# Altium project MB1297.PrjPcb
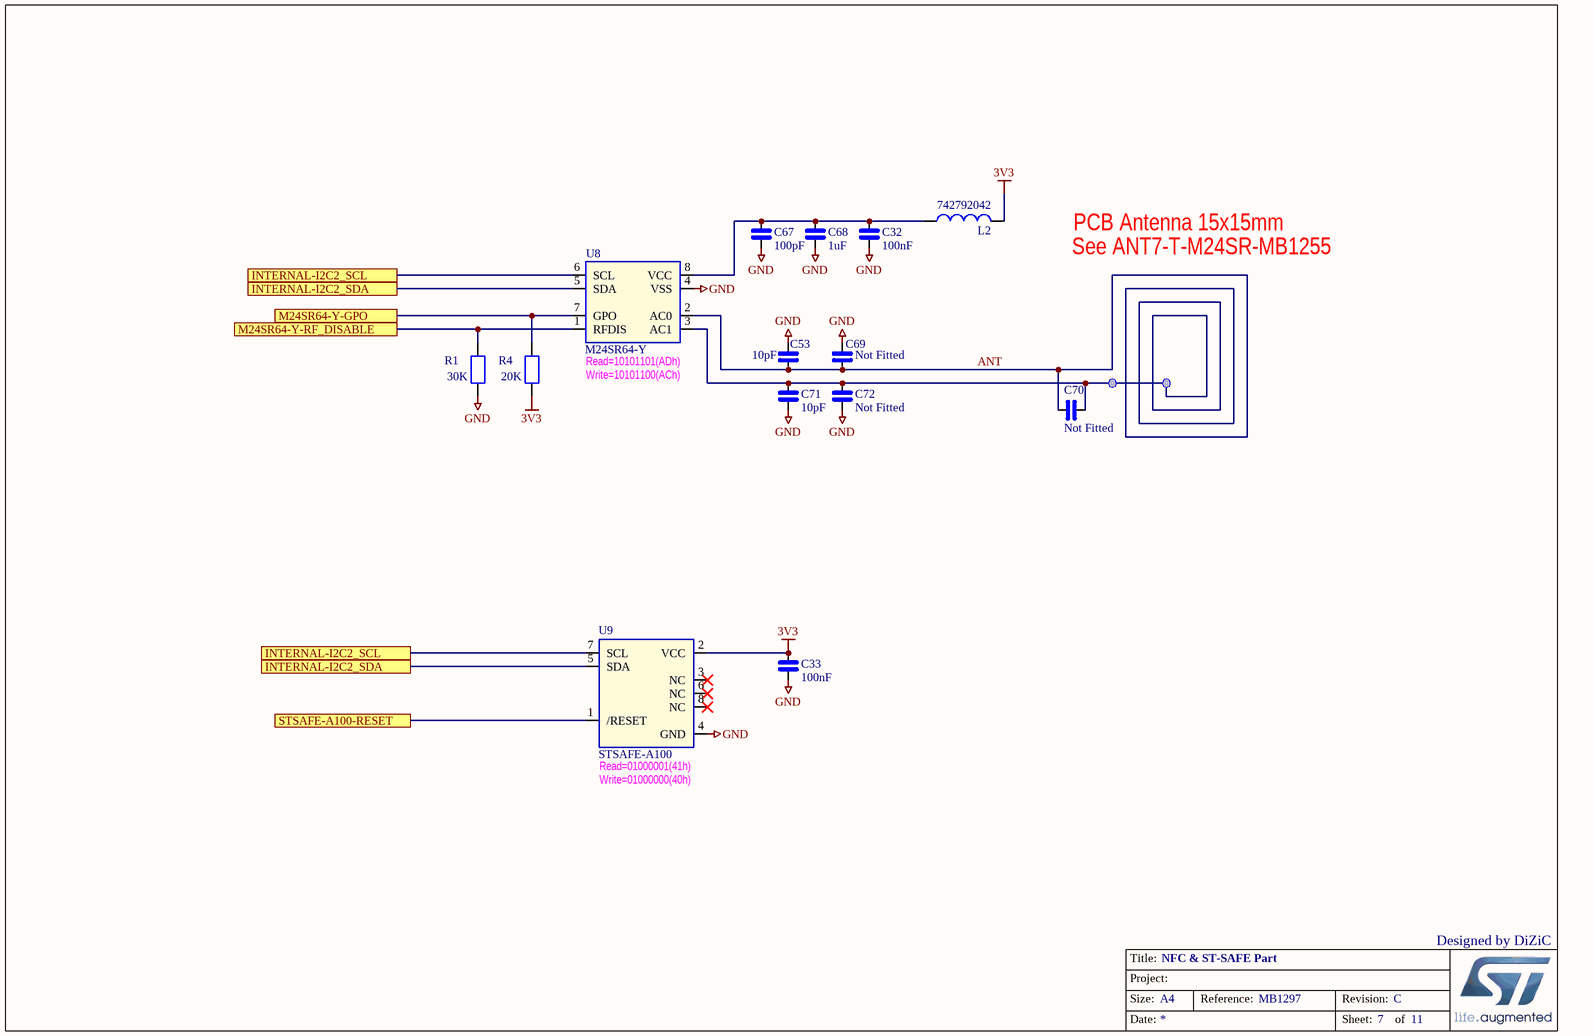
[diagram p0: MB1297_NFC_SAFE.SchDoc]
1 sheet, 14 parts. Net scope: flat (ports and power ports of the same name join across sheets).
Board file: MB1297.PcbDoc

## Sheet MB1297_NFC_SAFE.SchDoc: NFC & ST-SAFE Part
size A4; DocumentNumber: MB1297; Revision: C; SheetNumber: 7; SheetTotal: 11

### Parts
C32  100nF  [0402_CAP_NPOL]
C33  100nF  [0402_CAP_NPOL]
C53  10pF  [0402_CAP_NPOL]
C67  100pF  [0402_CAP_NPOL]
C68  1uF  [0402_CAP_NPOL]
C69  Not Fitted  [0402_CAP_NPOL]
C70  Not Fitted  [0402_CAP_NPOL]
C71  10pF  [0402_CAP_NPOL]
C72  Not Fitted  [0402_CAP_NPOL]
L2  742792042  [0603L]
R1  30K  [0402_RES]
R4  20K  [0402_RES]
U8  M24SR64-Y  [SOP8]
U9  STSAFE-A100  [SOP8]

### Ports
INTERNAL-I2C2_SCL, INTERNAL-I2C2_SDA, M24SR64-Y-GPO, M24SR64-Y-RF_DISABLE, STSAFE-A100-RESET

### Nets
3V3: C33.1 L2.2 R4.1 U9.2(VCC)
GND: C32.2 C33.2 C53.2 C67.2 C68.2 C69.2 C71.2 C72.2 R1.1 U8.4(VSS) U9.4(GND)
ANT: C53.1 C69.1 C70.1 C70.2 C71.1 C72.1 U8.2(AC0) U8.3(AC1)
NetC32_1: C32.1 C67.1 C68.1 L2.1 U8.8(VCC)
NetR1_2: R1.2 U8.1(RFDIS) ; port M24SR64-Y-RF_DISABLE
NetR4_2: R4.2 U8.7(GPO) ; port M24SR64-Y-GPO
NetU8_5: U8.5(SDA) U9.5(SDA) ; port INTERNAL-I2C2_SDA
NetU8_6: U8.6(SCL) U9.7(SCL) ; port INTERNAL-I2C2_SCL
NetU9_1: U9.1(/RESET) ; port STSAFE-A100-RESET

Not connected (* = marked no-connect by the designer): U9 3(NC)* 6(NC)* 8(NC)*

### Notes on the sheet
- PCB Antenna 15x15mm
- See ANT7-T-M24SR-MB1255
- (near U8) Read=10101101(ADh)
- Write=10101100(ACh)
- (near U9) Read=01000001(41h)
- (near U9) Write=01000000(40h)
- Designed by DiZiC
- Title:
- Project:
- Size:
- Date:
- A4
- Reference:
- Sheet:
- Revision:
- of

### Library data of the parts
C32 C33 C53 C67-C72 = CAP_NPOL: Capacitor_not polarized
L2 = Inductor: Value: 100uH; Published: 8-Jun-2000; Revision: July-2002: Re-released for DXP Platform.; Publisher: Altium Limited
R1 R4 = RES: Resistor
U8 = M24SR64-Y: M24SR64-Y  64K_EEPROM NFC/RFID